# Altium schematic sheet MPU6050.SchDoc
size A4
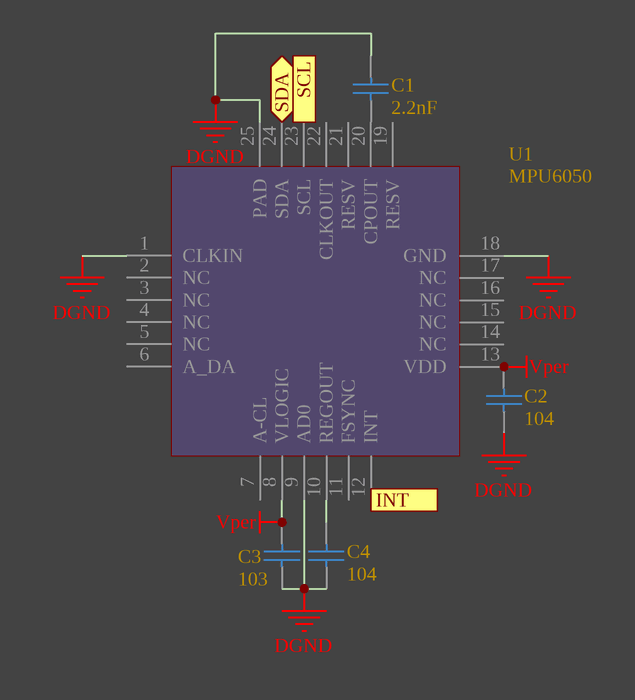
[diagram p0: MPU6050.SchDoc]

## Parts
C1  2.2nF  [C0402]
C2  104  [C0402]
C3  103  [C0402]
C4  104  [C0402]
U1  MPU6050  [QFN-24_4x4x05P]

## Ports
INT (out), SCL (in), SDA (bidir)

## Nets
DGND: C1.2 C2.1 C3.1 C4.1 U1.1(CLKIN) U1.9(AD0) U1.18(GND) U1.25(PAD)
Vper: C2.2 C3.2 U1.8(VLOGIC) U1.13(VDD)
INT: U1.12(INT) ; port INT
SCL: U1.23(SCL) ; port SCL
SDA: U1.24(SDA) ; port SDA
NetC1_1: C1.1 U1.20(CPOUT)
NetC4_2: C4.2 U1.10(REGOUT)

Not connected (* = marked no-connect by the designer): U1 2(NC) 3(NC) 4(NC) 5(NC) 6(A_DA) 7(A-CL) 11(FSYNC) 14(NC) 15(NC) 16(NC) 17(NC) 19(RESV) 21(RESV) 22(CLKOUT)

## Library data of the parts
C1-C4 = 电容: Capacitor; Value: 22pF; Published: 8-Jun-2000; LatestRevisionDate: 17-Jul-2002; LatestRevisionNote: Re-released for DXP Platform.; PackageReference: RAD-0.3; Publisher: Altium Limited; PackageDescription: Radial Cap, Thru-Hole; 2 Leads; 0.3 in Pin Spacing